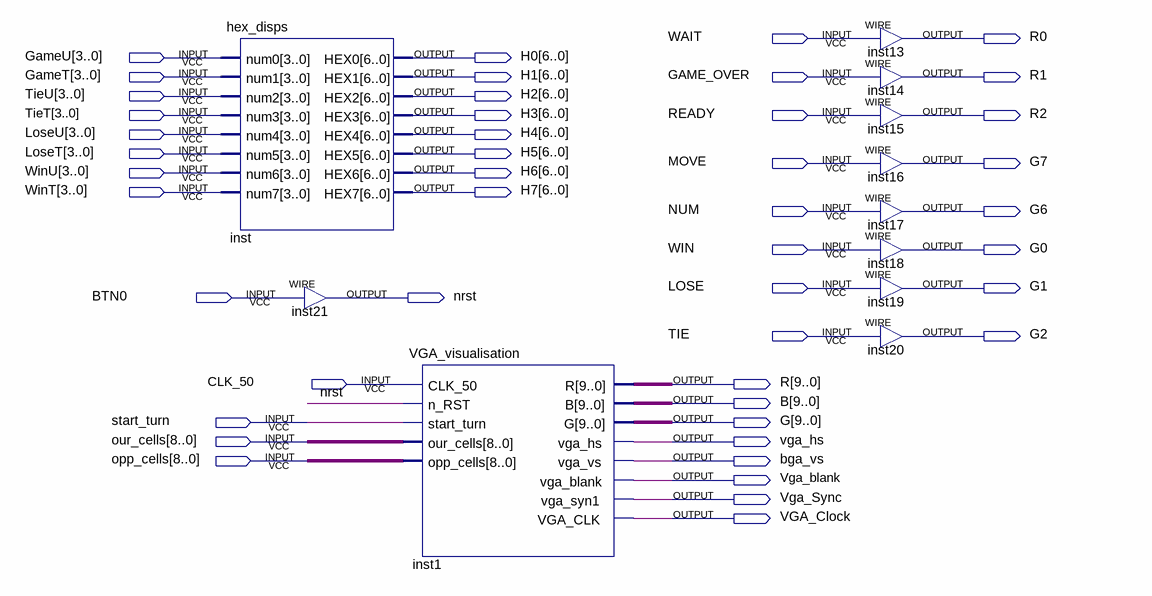
[diagram p0: schematic sheet]
// Quartus schematic I_O_Manager_VGA.bdf as structural Verilog: 11 symbols, 46 pins
module I_O_Manager_VGA (
  input  WAIT,
  input  [3:0] GameU,
  input  [3:0] GameT,
  input  GAME_OVER,
  input  [3:0] TieU,
  input  [3:0] TieT,
  input  READY,
  input  [3:0] LoseU,
  input  [3:0] LoseT,
  input  MOVE,
  input  [3:0] WinU,
  input  [3:0] WinT,
  input  NUM,
  input  WIN,
  input  LOSE,
  input  BTN0,
  input  TIE,
  input  CLK_50,
  input  start_turn,
  input  [8:0] our_cells,
  input  [8:0] opp_cells,
  output R0,
  output [6:0] H0,
  output [6:0] H1,
  output R1,
  output [6:0] H2,
  output [6:0] H3,
  output R2,
  output [6:0] H4,
  output [6:0] H5,
  output G7,
  output [6:0] H6,
  output [6:0] H7,
  output G6,
  output G0,
  output G1,
  output nrst,
  output G2,
  output [9:0] R,
  output [9:0] B,
  output [9:0] G,
  output vga_hs,
  output bga_vs,
  output Vga_blank,
  output Vga_Sync,
  output VGA_Clock
);

  hex_disps inst (
    .num0(GameU), .num1(GameT), .num2(TieU), .num3(TieT), .num4(LoseU), .num5(LoseT), .num6(WinU),
    .num7(WinT), .HEX0(H0), .HEX1(H1), .HEX2(H2), .HEX3(H3), .HEX4(H4), .HEX5(H5), .HEX6(H6), .HEX7(H7));
  assign nrst = BTN0;  // WIRE inst21
  VGA_visualisation inst1 (
    .CLK_50(CLK_50), .n_RST(nrst), .start_turn(start_turn), .our_cells(our_cells), .opp_cells(opp_cells),
    .R(R), .B(B), .G(G), .vga_hs(vga_hs), .vga_vs(bga_vs), .vga_blank(Vga_blank), .vga_syn1(Vga_Sync),
    .VGA_CLK(VGA_Clock));
  assign R[0] = WAIT;  // WIRE inst13
  assign R[1] = GAME_OVER;  // WIRE inst14
  assign R[2] = READY;  // WIRE inst15
  assign G[7] = MOVE;  // WIRE inst16
  assign G[6] = NUM;  // WIRE inst17
  assign G[0] = WIN;  // WIRE inst18
  assign G[1] = LOSE;  // WIRE inst19
  assign G[2] = TIE;  // WIRE inst20

  assign G0 = G[0];
  assign G1 = G[1];
  assign G2 = G[2];
  assign G6 = G[6];
  assign G7 = G[7];
  assign R0 = R[0];
  assign R1 = R[1];
  assign R2 = R[2];
endmodule
